# Altium schematic sheet USB.SchDoc
size A3; SheetNumber: 7; SheetTotal: 7
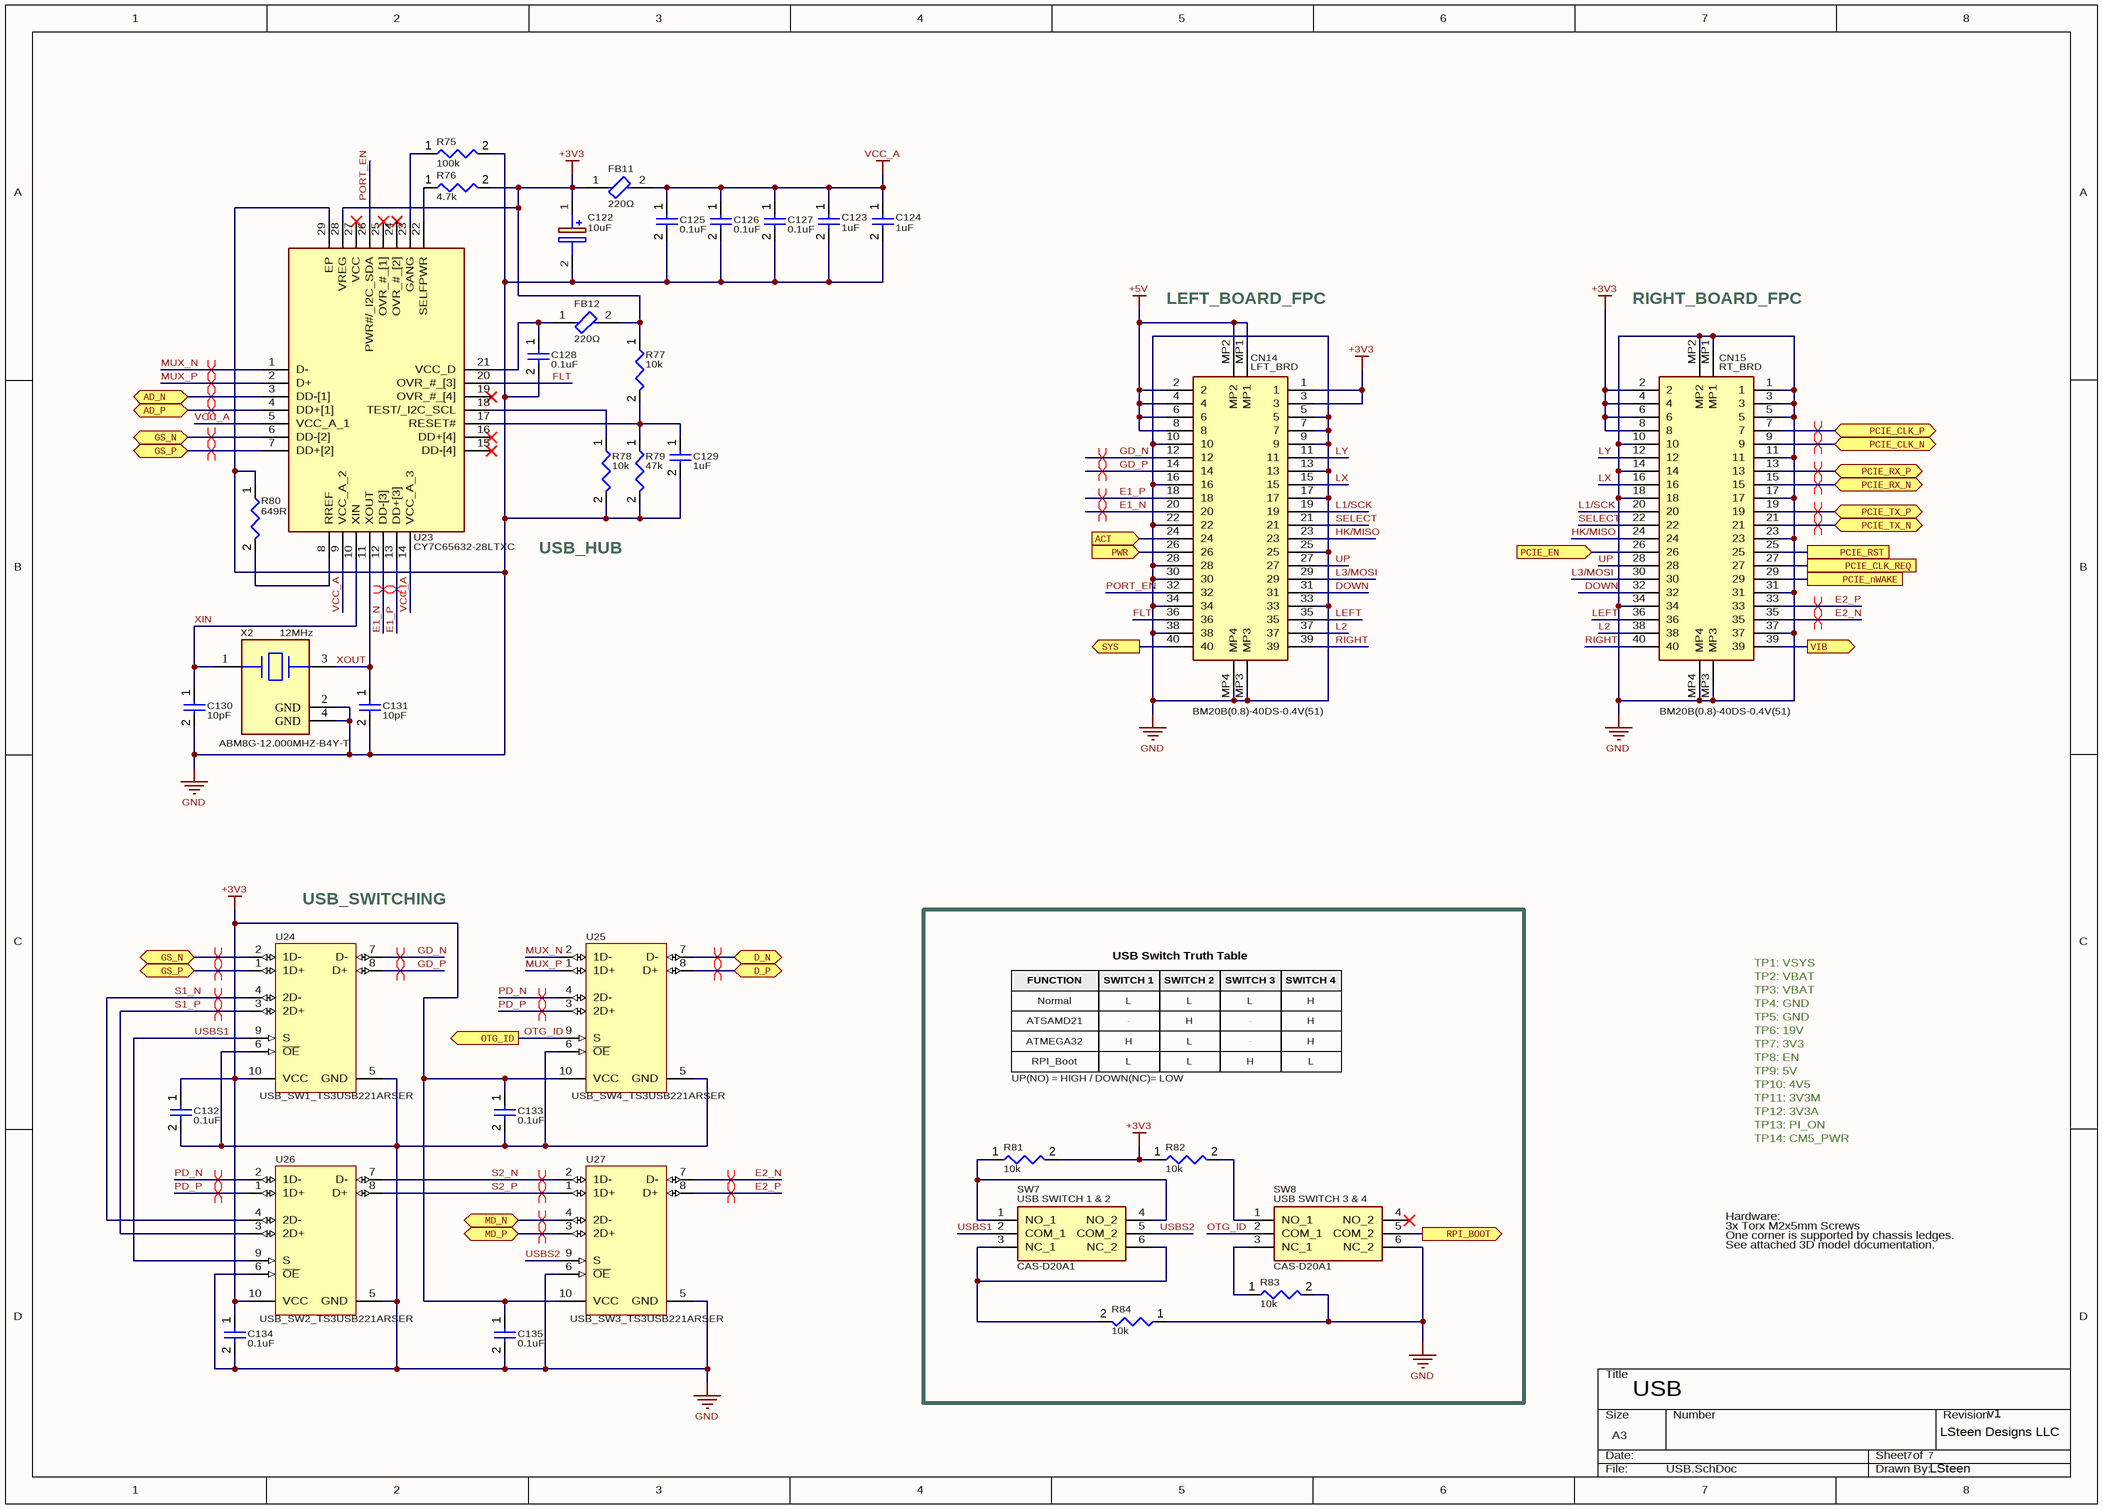
[diagram p0: USB.SchDoc]

## Parts
C122  10uF  [CAPAE430X395N]
C123  1uF  [CAPC0603(1608)100_L]
C124  1uF  [CAPC0603(1608)100_L]
C125  0.1uF  [CAPC1005X56X25LL10T15]
C126  0.1uF  [CAPC1005X56X25LL10T15]
C127  0.1uF  [CAPC1005X56X25LL10T15]
C128  0.1uF  [CAPC1005X56X25LL10T15]
C129  1uF  [CAPC0603(1608)100_L]
C130  10pF  [CAPC1005X56X25LL10T15]
C131  10pF  [CAPC1005X56X25LL10T15]
C132  0.1uF  [CAPC1005X56X25LL10T15]
C133  0.1uF  [CAPC1005X56X25LL10T15]
C134  0.1uF  [CAPC1005X56X25LL10T15]
C135  0.1uF  [CAPC1005X56X25LL10T15]
CN14  LFT_BRD  [BM20B0840DS04V51]
CN15  RT_BRD  [BM20B0840DS04V51]
FB11  220Ω  [FP-BLM18-0_15-t0_5-IPC_B]
FB12  220Ω  [FP-BLM18-0_15-t0_5-IPC_B]
R75  100k  [RESC0402(1005)_L]
R76  4.7k  [RESC0402(1005)_L]
R77  10k  [RESC0402(1005)_L]
R78  10k  [RESC0402(1005)_L]
R79  47k  [RESC0402(1005)_L]
R80  649R  [RESC0402(1005)_L]
R81  10k  [RESC0402(1005)_L]
R82  10k  [RESC0402(1005)_L]
R83  10k  [RESC0402(1005)_L]
R84  10k  [RESC0402(1005)_L]
SW7  USB_SW1/SW2  [CASD20A1]  (value not drawn)
SW8  USB_SW3/SW4  [CASD20A1]  (value not drawn)
U23  CY7C65632-28LTXC  [QFN50P500X500X80-29N-D]
U24  USB_SW1_TS3USB221ARSER  [RSE0010A_V]
U25  USB_SW4_TS3USB221ARSER  [RSE0010A_V]
U26  USB_SW2_TS3USB221ARSER  [RSE0010A_V]
U27  USB_SW3_TS3USB221ARSER  [RSE0010A_V]
X2  12MHz  [FP-ABM8G-MFG]

## Blocks framed on the sheet
USB Switch Truth Table: R81-R84 SW7 SW8

## Ports
ACT (in, see Module A IO[5A]), AD_N (bidir, see Audio[1C]), AD_P (bidir, see Audio[1C]), D_N (bidir, see Module B High-Speed[2A]), D_P (bidir, see Module B High-Speed[2A]), GS_N (bidir, see USB[1B]), GS_N (bidir, see USB[1C]), GS_P (bidir, see USB[1B]), GS_P (bidir, see USB[1C]), MD_N (bidir, see Power[6C]), MD_P (bidir, see Power[6C]), OTG_ID (out, see Module B High-Speed[2A]), PCIE_CLK_N (bidir, see Module B High-Speed[3A]), PCIE_CLK_P (bidir, see Module B High-Speed[3A]), PCIE_CLK_REQ (see Module B High-Speed[3A]), PCIE_EN (in, see Module A IO[5B]), PCIE_nWAKE (see Module A IO[5B]), PCIE_RST (see Module B High-Speed[3A]), PCIE_RX_N (bidir, see Module B High-Speed[3A]), PCIE_RX_P (bidir, see Module B High-Speed[3A]), PCIE_TX_N (bidir, see Module B High-Speed[4B]), PCIE_TX_P (bidir, see Module B High-Speed[3A]), PWR (in, see Module A IO[5A]), RPI_BOOT (out, see Module A IO[4A]), SYS (out, see Module A IO[5B]), VIB (out, see Module A IO[5B])

## Nets
+3V3: C122.1(+) C132.1 C133.1 C134.1 C135.1 CN14.1 CN14.3 CN15.2 CN15.4 CN15.6 CN15.8 FB11.1 FB12.2 R76.2 R77.1 R81.2 R82.1 U23.28(VREG) U24.10(VCC) U25.10(VCC) U26.10(VCC) U27.10(VCC)
+5V: CN14.2 CN14.4 CN14.6 CN14.8 CN14.MP1 CN14.MP2
GND: C122.2(-) C123.2 C124.2 C125.2 C126.2 C127.2 C128.2 C129.2 C130.2 C131.2 C132.2 C133.2 C134.2 C135.2 CN14.5 CN14.7 CN14.9 CN14.10 CN14.13 CN14.16 CN14.17 CN14.22 CN14.25 CN14.28 CN14.30 CN14.33 CN14.34 CN14.38 CN14.MP3 CN14.MP4 CN15.1 CN15.3 CN15.5 CN15.10 CN15.11 CN15.14 CN15.17 CN15.18 CN15.23 CN15.31 CN15.34 CN15.37 CN15.MP1 CN15.MP2 CN15.MP3 CN15.MP4 R75.2 R78.2 R79.2 R80.1 R83.2 R84.1 SW8.6(NC_2) U23.29(EP) U24.5(GND) U24.6(~{OE}) U25.5(GND) U25.6(~{OE}) U26.5(GND) U26.6(~{OE}) U27.5(GND) U27.6(~{OE}) X2.2(GND) X2.4(GND)
VCC_A: C123.1 C124.1 C125.1 C126.1 C127.1 FB11.2 U23.5(VCC_A_1) U23.9(VCC_A_2) U23.14(VCC_A_3)
ACT: CN14.24 ; port ACT
AD_N: U23.3(DD-[1]) ; port AD_N
AD_P: U23.4(DD+[1]) ; port AD_P
D_N: U25.7(D-) ; port D_N
D_P: U25.8(D+) ; port D_P
DOWN: CN14.31 CN15.32
E1_N: CN14.20 U23.12(DD-[3])
E1_P: CN14.18 U23.13(DD+[3])
E2_N: CN15.35 U27.7(D-)
E2_P: CN15.33 U27.8(D+)
FLT: CN14.36 U23.20(OVR_#_[3])
GD_N: CN14.12 U24.7(D-)
GD_P: CN14.14 U24.8(D+)
GS_N: U23.6(DD-[2]) U24.2(1D-) ; port GS_N
GS_P: U23.7(DD+[2]) U24.1(1D+) ; port GS_P
HK/MISO: CN14.23 CN15.24
L1/SCK: CN14.19 CN15.20
L2: CN14.37 CN15.38
L3/MOSI: CN14.29 CN15.30
LEFT: CN14.35 CN15.36
LX: CN14.15 CN15.16
LY: CN14.11 CN15.12
MD_N: U27.4(2D-) ; port MD_N
MD_P: U27.3(2D+) ; port MD_P
MUX_N: U23.1(D-) U25.2(1D-)
MUX_P: U23.2(D+) U25.1(1D+)
OTG_ID: SW8.2(COM_1) U25.9(S) ; port OTG_ID
PCIE_CLK_N: CN15.9 ; port PCIE_CLK_N
PCIE_CLK_P: CN15.7 ; port PCIE_CLK_P
PCIE_CLK_REQ: CN15.27 ; port PCIE_CLK_REQ
PCIE_EN: CN15.26 ; port PCIE_EN
PCIE_nWAKE: CN15.29 ; port PCIE_nWAKE
PCIE_RST: CN15.25 ; port PCIE_RST
PCIE_RX_N: CN15.15 ; port PCIE_RX_N
PCIE_RX_P: CN15.13 ; port PCIE_RX_P
PCIE_TX_N: CN15.21 ; port PCIE_TX_N
PCIE_TX_P: CN15.19 ; port PCIE_TX_P
PD_N: U25.4(2D-) U26.2(1D-)
PD_P: U25.3(2D+) U26.1(1D+)
PORT_EN: CN14.32 U23.26(PWR#/_I2C_SDA)
PWR: CN14.26 ; port PWR
RIGHT: CN14.39 CN15.40
RPI_BOOT: SW8.5(COM_2) ; port RPI_BOOT
S1_N: U24.4(2D-) U26.4(2D-)
S1_P: U24.3(2D+) U26.3(2D+)
S2_N: U26.7(D-) U27.2(1D-)
S2_P: U26.8(D+) U27.1(1D+)
SELECT: CN14.21 CN15.22
SYS: CN14.40 ; port SYS
UP: CN14.27 CN15.28
USBS1: SW7.2(COM_1) U24.9(S) U26.9(S)
USBS2: SW7.5(COM_2) U27.9(S)
VIB: CN15.39 ; port VIB
XIN: C130.1 U23.10(XIN) X2.1
XOUT: C131.1 U23.11(XOUT) X2.3
NetC128_1: C128.1 FB12.1 U23.21(VCC_D)
NetC129_1: C129.1 R77.2 R79.1 U23.17(RESET#)
NetR75_1: R75.1 U23.23(GANG)
NetR76_1: R76.1 U23.22(SELFPWR)
NetR78_1: R78.1 U23.18(TEST/_I2C_SCL)
NetR80_2: R80.2 U23.8(RREF)
NetR81_1: R81.1 SW7.1(NO_1) SW7.4(NO_2)
NetR82_2: R82.2 SW8.1(NO_1)
NetR83_1: R83.1 SW8.3(NC_1)
NetR84_2: R84.2 SW7.3(NC_1) SW7.6(NC_2)

Not connected (* = marked no-connect by the designer): SW8 4(NO_2)*; U23 15(DD-[4])* 16(DD+[4])* 19(OVR_#_[4])* 24(OVR_#_[2])* 25(OVR_#_[1])* 27(VCC)*

## Layout directives
differential pair; differential pair class USB 2.0: AD_N, AD_P, D_N, D_P, E1_N, E1_P, E2_N, E2_P, GD_N, GD_P, GS_N, GS_P, MD_N, MD_P, MUX_N, MUX_P, PD_N, PD_P, S1_N, S1_P, S2_N, S2_P
differential pair; differential pair class PCIe Gen 3x1: PCIE_CLK_N, PCIE_CLK_P, PCIE_RX_N, PCIE_RX_P, PCIE_TX_N, PCIE_TX_P

## Notes on the sheet
- LEFT_BOARD_FPC
- RIGHT_BOARD_FPC
- USB_HUB
- (near CN14) BM20B(0.8)-40DS-0.4V(51)
- (near CN15) BM20B(0.8)-40DS-0.4V(51)
- (near X2) ABM8G-12.000MHZ-B4Y-T
- (near U24) USB_SWITCHING
- FUNCTION
- SWITCH 1
- SWITCH 2
- SWITCH 3
- SWITCH 4
- TP1: VSYS
- TP2: VBAT
- TP3: VBAT
- Normal Operation
- ATSAMD21 Flash
- ATMEGA32 Flash
- L
- -
- H
- TP4: GND
- TP5: GND
- TP6: 19V
- TP7: 3V3
- RPI_Boot
- UP(NO) = HIGH / DOWN(NC)= LOW
- TP8: EN
- TP9: 5V
- TP10: 4V5
- TP11: 3V3M
- TP12: 3V3A
- TP13: PI_ON
- TP14: CM5_PWR
- (near SW7) USB SWITCH 1 & 2
- (near SW8) USB SWITCH 3 & 4
- Hardware:
- 3x Torx M2x5mm Screws
- One corner is supported by chassis ledges.
- See attached 3D model documentation.
- (near SW7) CAS-D20A1
- CAS-D20A1
- USB
- 7
- LSteen Designs LLC
- v1
- LSteen

## Library data of the parts
C122 = UZG1C100MCL1GB: Capacitor Polarised; Manufacturer_Name: Nichicon; Datasheet Link: https://www.mouser.com/datasheet/2/293/e_uzg-2943377.pdf; Height: 3.95mm; Manufacturer_Part_Number: UZG1C100MCL1GB; Mouser Part Number: 647-UZG1C100MCL1GB; Mouser Price/Stock: https://www.mouser.co.uk/ProductDetail/Nichicon/UZG1C100MCL1GB?qs=UBiR96IgLrQPAKI%2FbNPsyA%3D%3D; Arrow Part Number: UZG1C100MCL1GB; Arrow Price/Stock: https://www.arrow.com/en/products/uzg1c100mcl1gb/nichicon
C123 C124 C129 = CMP-001-00076-4: Chip Capacitor, 1uF +/-20%, 10V, 0603, Thickness 1 mm; Tolerance: 10%; Mounting Technology: SMT; Case/Package: 0603; Pins: 2; Min Operating Temperature: -55°C; Max Operating Temperature: 85°C; Value: 1uF; Voltage Rating: 10V
C125-C128 C132-C135 = CMP-001-00001-6: Chip Capacitor, 0.1 uF, +/- 5%, 16 V, 0402 (1005 Metric); Capacitor Type: Ceramic; Voltage Rating: 16V; Max Operating Temperature: 125°C; Min Operating Temperature: -55°C; Case/Package: 0402; Value: 0.1uF; Mounting Technology: SM; Pins: 2; Tolerance: 5%; RoHS Compliant: True
C130 C131 = CMP-001-00001-6: Chip Capacitor, 10 pF, +/- 5%, 16 V, 0402 (1005 Metric); Capacitor Type: Ceramic; Voltage Rating: 16V; Max Operating Temperature: 125°C; Min Operating Temperature: -55°C; Case/Package: 0402; Value: 10pF; Mounting Technology: SM; Pins: 2; Tolerance: 5%; RoHS Compliant: True
CN14 CN15 = BM20B(0.8)-40DS-0.4V(51): Connector; Manufacturer_Name: Hirose; Datasheet Link: https://datasheet.datasheetarchive.com/originals/distributors/Datasheets-DGA17/1065509.pdf; Height: 0.9mm; Manufacturer_Part_Number: BM20B(0.8)-40DS-0.4V(51); Mouser Part Number: 798-BM20B0840DS04V51; Mouser Price/Stock: https://www.mouser.co.uk/ProductDetail/Hirose-Connector/BM20B0.8-40DS-0.4V51?qs=AAveGqk956F9p8KJryTUVg%3D%3D; Supplier 1: Mouser; Supplier Part Number 1: 798-BM20B0840DS04V51; System: Connector
FB11 FB12 = CMP-06046-002311-1: Chip Ferrite Bead, 0603, 220Ω @ 100MHz, 25%, 0.04Ω, 2.5A; RoHS Compliant: Yes
R75 = CMP-009-00138-3: Chip Resistor, 100 kOhms, +/-5 %, 63 mW, -55 to 155 degC, 0402; Tolerance: 5%; Power: 63mW; Max Operating Temperature: 155°C; Pins: 2; Value: 100k; Min Operating Temperature: -55°C; Case/Package: 0402
R76 = CMP-009-00138-3: Chip Resistor, 4.7 kOhms, +/-5 %, 63 mW, -55 to 155 degC, 0402; Tolerance: 5%; Power: 63mW; Max Operating Temperature: 155°C; Pins: 2; Value: 4.7k; Min Operating Temperature: -55°C; Case/Package: 0402
R77 R78 R81-R84 = CMP-009-00138-3: Chip Resistor, 10 kOhms, +/-5 %, 63 mW, -55 to 155 degC, 0402; Tolerance: 5%; Power: 63mW; Max Operating Temperature: 155°C; Pins: 2; Value: 10k; Min Operating Temperature: -55°C; Case/Package: 0402
R79 = CMP-009-00138-3: Chip Resistor, 47 kOhms, +/-5 %, 63 mW, -55 to 155 degC, 0402; Tolerance: 5%; Power: 63mW; Max Operating Temperature: 155°C; Pins: 2; Value: 47k; Min Operating Temperature: -55°C; Case/Package: 0402
R80 = CMP-009-00138-3: Chip Resistor, 649 Ohms, +/-5 %, 63 mW, -55 to 155 degC, 0402; Tolerance: 5%; Power: 63mW; Max Operating Temperature: 155°C; Pins: 2; Value: 649R; Min Operating Temperature: -55°C; Case/Package: 0402
SW7 SW8 = CAS-D20A1: Switch; Manufacturer_Name: Copal Electronics; Datasheet Link: https://www.nidec-copal-electronics.com/e/catalog/switch/cas.pdf; Height: 2.5mm; Manufacturer_Part_Number: CAS-D20A1; Supplier 1: Mouser; Supplier Part Number 1: 229-CAS-D20A1
U23 = CY7C65632-28LTXC: Integrated Circuit; Manufacturer_Name: Infineon; Datasheet Link: https://www.cypress.com/file/114101/download; Height: 0.8mm; Manufacturer_Part_Number: CY7C65632-28LTXC; Mouser Part Number: 727-CY7C65632-28LTXC; Mouser Price/Stock: https://www.mouser.co.uk/ProductDetail/Cypress-Semiconductor/CY7C65632-28LTXC?qs=3YAjQa1E1OlgEZvLiuQ0xA%3D%3D; Arrow Part Number: CY7C65632-28LTXC; Arrow Price/Stock: https://www.arrow.com/en/products/cy7c65632-28ltxc/cypress-semiconductor; Supplier 1: Mouser; Supplier Part Number 1: 727-CY7C65632-28LTXC
U24-U27 = CMP-0309-00017-2: ESD Protected,High-Speed USB 2.0 (480-Mbps) 1:2 Multiplexer / Demultiplexer Switch, 1:2 Mux / Demux, 6 ohm RON, 2.5 to 3.3V, -40 to 85 degC, 10-Pin UQFN (RSE), Green (RoHS & no Sb/Br); Manufacturer: Texas Instruments; tpd max(ns): 0.25; RON Mis-match(Max)(Ohms): 0.2; OFF Time(Max)(ns): 12; Architecture: "1","2 mux/demux"; IL OFF(Max)(nA): 2; SubFamily: USB Switch; ESD HBM(kV): +/-7; ron(max)(ohms): 6; ON Time(Max)(ns): 30; Bandwidth(MHz): 900; RON Flatness(Max)(Ohms): 1; Vcc range(V): 2.3 to 3.6; Mounting Technology: Surface Mount; ComponentLink2URL: http://www.ti.com/lit/ml/mpqf186c/mpqf186c.pdf; PackageDescription: 10-Leads Plastic Quad Flatpack No-Lead, 2 x 1.5 x 0.55 mm Body, 0.5 mm Pitch; ComponentLink1URL: http://www.ti.com/general/docs/lit/getliterature.tsp?genericPartNumber=TS3USB221A&fileType=pdf; PackageReference: RSE0010A; ComponentLink2Description: Package Specification; PartNumber: TS3USB221ARSER; Code_JEDEC: MO-288-UEFD; DatasheetVersion: SCDS277; ComponentLink1Description: Datasheet; Eco-Plan: Green (RoHS & no Sb/Br); Number of Channels: 2; PackageVersion: revD, Jan-2011; ICC(uA): 30
X2 = CMP-27762-015546-1: Crystal 12MHz ±30ppm (Tol) ±30ppm (Stability) 10pF FUND 120Ω 4-Pin SMD T/R; ESR (Equivalent Series Resistance): 120R; Height: 1mm; Operating Frequency: 12 MHz; Case/Package: CSMD; Max Operating Temperature: 70°C; Load Capacitance: 10pF; Series: ABM8G; Depth: 2.5mm; Package Quantity: 1000; Frequency: 12MHz; Min Operating Temperature: -20°C; Length: 3.2mm; Termination: SMD/SMT; Frequency Tolerance: 30ppm; Frequency Stability: 30ppm; Tolerance: 30ppm; Lead Free: Lead Free; Number of Pins: 4; Mount: Surface Mount; Width: 2.5mm; Packaging: Tape and Reel